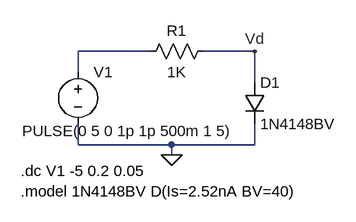
[diagram p0: schematic 3_12_tp2_ej4_pablo_gomez.asc]
3_12_tp2_ej4_pablo_gomez.asc, the LTspice schematic file:
Version 4
SHEET 1 880 680
WIRE 128 128 16 128
WIRE 288 128 208 128
WIRE 16 160 16 128
WIRE 288 176 288 128
WIRE 16 272 16 240
WIRE 160 272 16 272
WIRE 288 272 288 240
WIRE 288 272 160 272
WIRE 160 288 160 272
FLAG 160 288 0
FLAG 288 128 Vd
SYMBOL res 112 144 R270
WINDOW 0 32 56 VTop 2
WINDOW 3 0 56 VBottom 2
SYMATTR InstName R1
SYMATTR Value 1K
SYMBOL voltage 16 144 R0
WINDOW 123 0 0 Left 0
WINDOW 39 0 0 Left 0
WINDOW 3 -86 107 Left 2
SYMATTR InstName V1
SYMATTR Value PULSE(0 5 0 1p 1p 500m 1 5)
SYMBOL diode 272 176 R0
SYMATTR InstName D1
SYMATTR Value 1N4148BV
TEXT -72 312 Left 2 !.dc V1 -5 0.2 0.05
TEXT -72 344 Left 2 !.model 1N4148BV D(Is=2.52nA BV=40)

The netlist it stands for:
* 3_12_tp2_ej4_pablo_gomez.asc
R1 N001 Vd 1K
V1 N001 0 PULSE(0 5 0 1p 1p 500m 1 5)
D1 Vd 0 1N4148BV
.model D D
.lib standard.dio
.dc V1 -5 0.2 0.05
.model 1N4148BV D(Is=2.52nA BV=40)
.backanno
.end